# EAGLE design Carte-Marteaux (EAGLE 9.6.2)
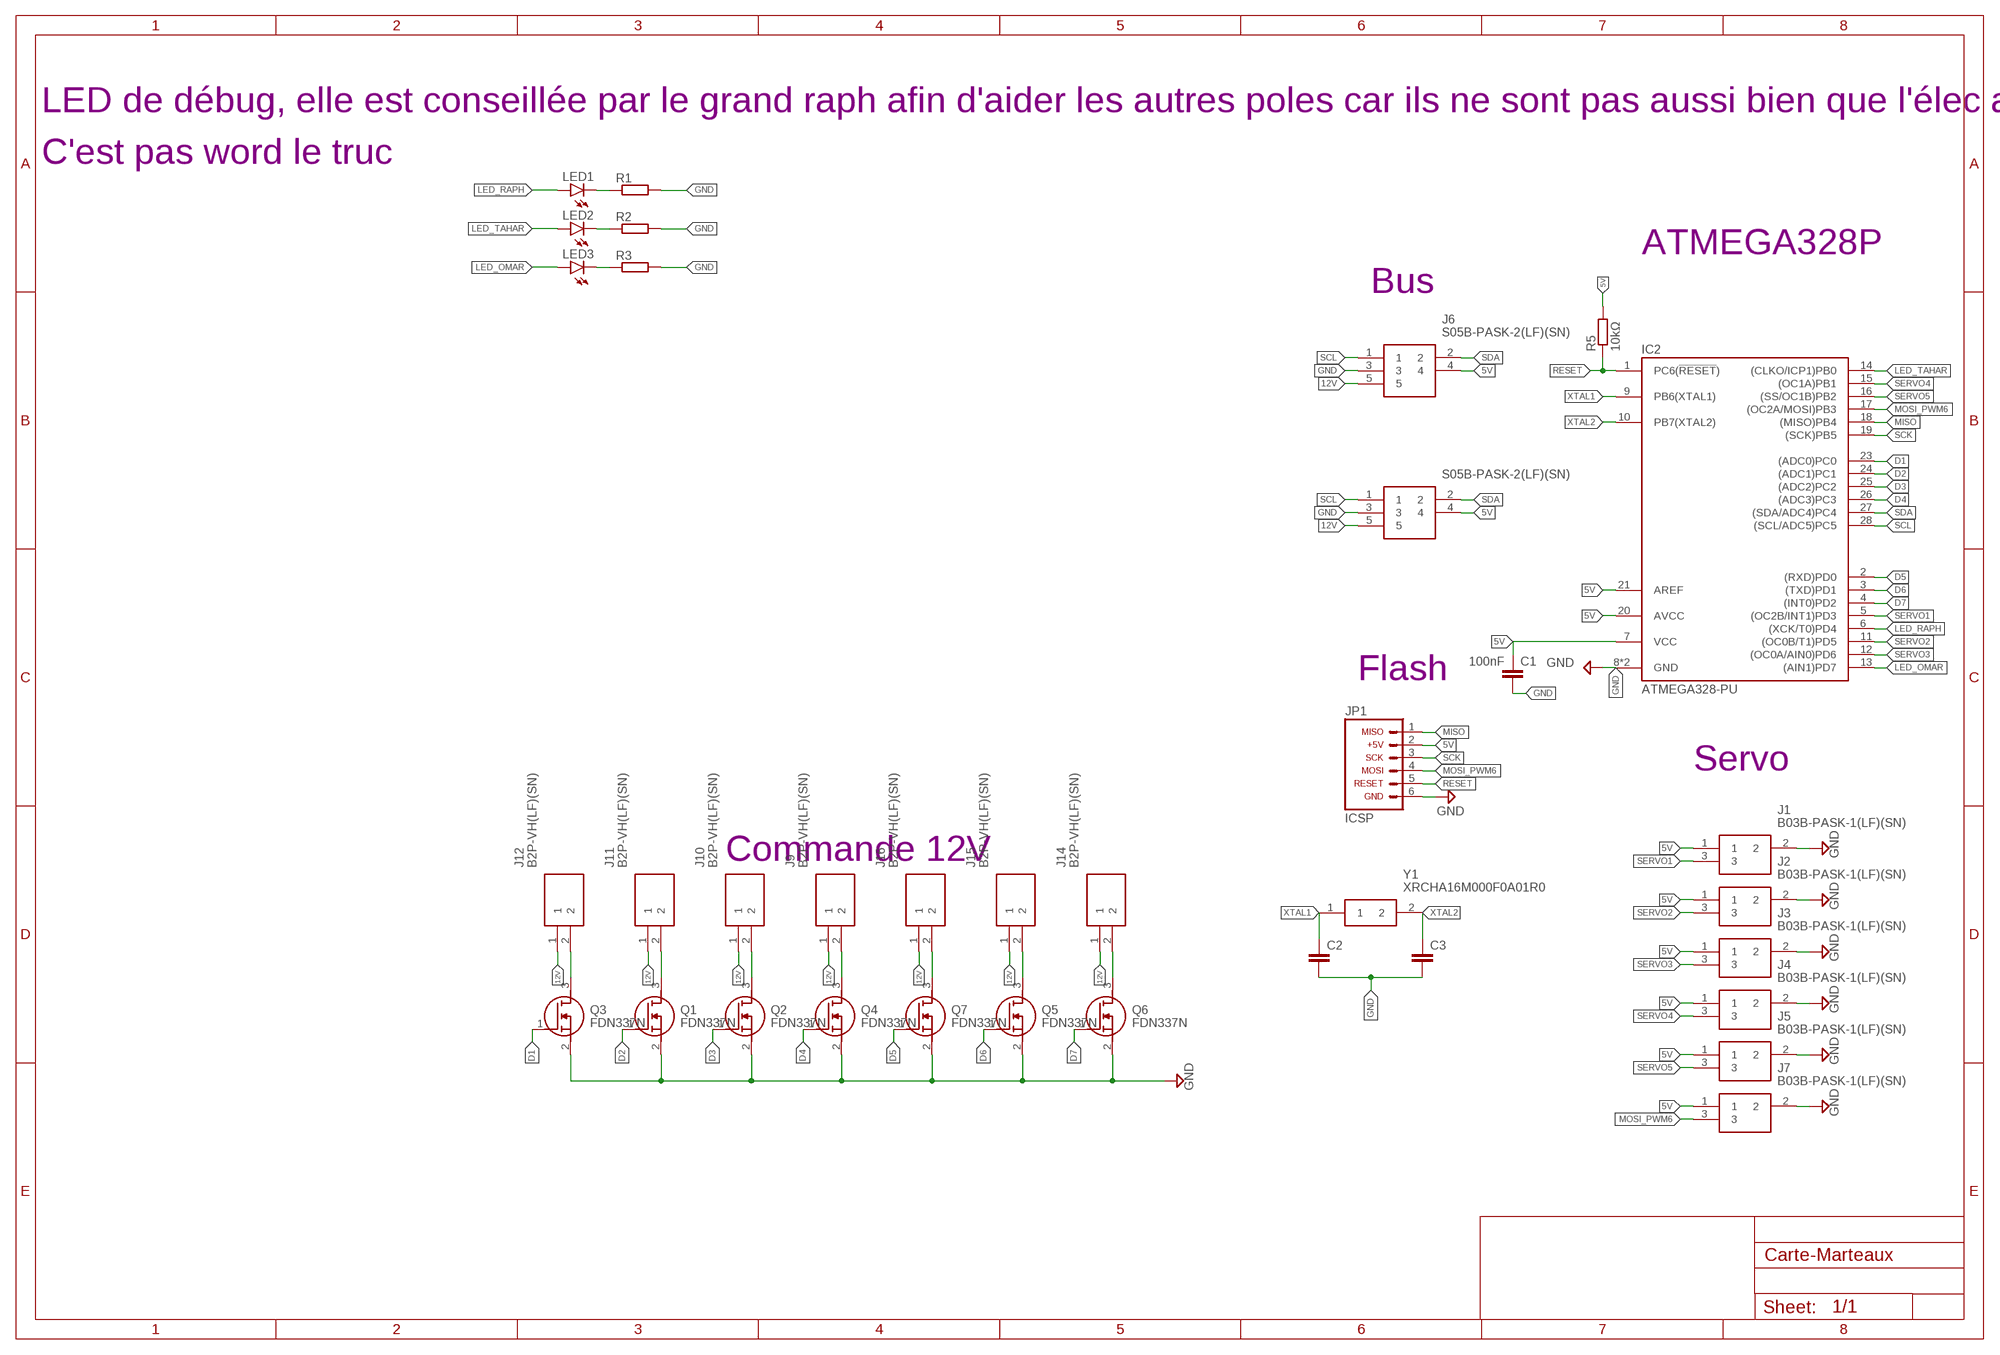
[diagram p0: schematic, sheet 1]

## Parts
C1  100nF  C-EUC0805  [C0805]
C2  C-EUC0402  [C0402]
C3  C-EUC0402  [C0402]
IC2  ATMEGA328-PU  [DIL28]
J1  B03B-PASK-1(LF)(SN)  [B03BPASK1LFSN]
J2  B03B-PASK-1(LF)(SN)  [B03BPASK1LFSN]
J3  B03B-PASK-1(LF)(SN)  [B03BPASK1LFSN]
J4  B03B-PASK-1(LF)(SN)  [B03BPASK1LFSN]
J5  B03B-PASK-1(LF)(SN)  [B03BPASK1LFSN]
J6  S05B-PASK-2(LF)(SN)  [S05B-PASK-2(LF)(SN)]
J7  B03B-PASK-1(LF)(SN)  [B03BPASK1LFSN]
J8  S05B-PASK-2(LF)(SN)  [S05B-PASK-2(LF)(SN)]
J9  B2P-VH(LF)(SN)  [SHDR2W114P0X396_1X2_786X850X94]
J10  B2P-VH(LF)(SN)  [SHDR2W114P0X396_1X2_786X850X94]
J11  B2P-VH(LF)(SN)  [SHDR2W114P0X396_1X2_786X850X94]
J12  B2P-VH(LF)(SN)  [SHDR2W114P0X396_1X2_786X850X94]
J14  B2P-VH(LF)(SN)  [SHDR2W114P0X396_1X2_786X850X94]
J15  B2P-VH(LF)(SN)  [SHDR2W114P0X396_1X2_786X850X94]
J16  B2P-VH(LF)(SN)  [SHDR2W114P0X396_1X2_786X850X94]
JP1  ARDUINO_CONN-ICSP  [CONN-2X03]
LED1  LEDCHIP-LED0805  [CHIP-LED0805]
LED2  LEDCHIP-LED0805  [CHIP-LED0805]
LED3  LEDCHIP-LED0805  [CHIP-LED0805]
Q1  FDN337N  [SOT95P237X112-3N]
Q2  FDN337N  [SOT95P237X112-3N]
Q3  FDN337N  [SOT95P237X112-3N]
Q4  FDN337N  [SOT95P237X112-3N]
Q5  FDN337N  [SOT95P237X112-3N]
Q6  FDN337N  [SOT95P237X112-3N]
Q7  FDN337N  [SOT95P237X112-3N]
R1  R-EU_R0805  [R0805]
R2  R-EU_R0805  [R0805]
R3  R-EU_R0805  [R0805]
R5  10kΩ  R-EU_R0805  [R0805]
Y1  XRCHA16M000F0A01R0  [XRCHA]

## Nets
5V: C1.1 IC2.7(VCC) IC2.20(AVCC) IC2.21(AREF) J1.1 J2.1 J3.1 J4.1 J5.1 J6.4 J7.1 J8.4 JP1.2 R5.2
12V: J6.5 J8.5 J9.1 J10.1 J11.1 J12.1 J14.1 J15.1 J16.1
D1: IC2.23((ADC0)PC0) Q3.1(G)
D2: IC2.24((ADC1)PC1) Q1.1(G)
D3: IC2.25((ADC2)PC2) Q2.1(G)
D4: IC2.26((ADC3)PC3) Q4.1(G)
D5: IC2.2((RXD)PD0) Q7.1(G)
D6: IC2.3((TXD)PD1) Q5.1(G)
D7: IC2.4((INT0)PD2) Q6.1(G)
GND: C1.2 C2.2 C3.2 IC2.8(GND) IC2.22(GND) J1.2 J2.2 J3.2 J4.2 J5.2 J6.3 J7.2 J8.3 JP1.6 Q1.2(S) Q2.2(S) Q3.2(S) Q4.2(S) Q5.2(S) Q6.2(S) Q7.2(S) R1.2 R2.2 R3.2
LED_OMAR: IC2.13((AIN1)PD7) LED3.A
LED_RAPH: IC2.6((XCK/T0)PD4) LED1.A
LED_TAHAR: IC2.14((CLKO/ICP1)PB0) LED2.A
MISO: IC2.18((MISO)PB4) JP1.1
MOSI_PWM6: IC2.17((OC2A/MOSI)PB3) J7.3 JP1.4
N$1: LED1.C R1.1
N$2: LED2.C R2.1
N$3: LED3.C R3.1
N$4: J12.2 Q3.3(D)
N$5: J11.2 Q1.3(D)
N$6: J10.2 Q2.3(D)
N$7: J9.2 Q4.3(D)
N$8: J16.2 Q7.3(D)
N$9: J15.2 Q5.3(D)
N$10: J14.2 Q6.3(D)
RESET: IC2.1(PC6(!RESET!)) JP1.5 R5.1
SCK: IC2.19((SCK)PB5) JP1.3
SCL: IC2.28((SCL/ADC5)PC5) J6.1 J8.1
SDA: IC2.27((SDA/ADC4)PC4) J6.2 J8.2
SERVO1: IC2.5((OC2B/INT1)PD3) J1.3
SERVO2: IC2.11((OC0B/T1)PD5) J2.3
SERVO3: IC2.12((OC0A/AIN0)PD6) J3.3
SERVO4: IC2.15((OC1A)PB1) J4.3
SERVO5: IC2.16((SS/OC1B)PB2) J5.3
XTAL1: C2.1 IC2.9(PB6(XTAL1)) Y1.1
XTAL2: C3.1 IC2.10(PB7(XTAL2)) Y1.2

## Notes on the sheet
- LED de débug, elle est conseillée par le grand raph afin d'aider les autres poles car ils ne sont pas aussi bien que l'élec aka les bg surtout Tahar
- C'est pas word le truc
- ATMEGA328P
- Bus
- Flash
- Servo
- Commande 12V

## Library data of the parts
C1 = INTech:C-EU: CAPACITOR, European symbol; SPICEPREFIX: C
C2 C3 = rcl:C-EU: CAPACITOR, European symbol; SPICEPREFIX: C
IC2 = INTech:ATMEGA328-PU: Atmel ATmega48/88/168/328 AVR Microcontroller; AVAILABILITY: Unavailable; DESCRIPTION: AVR AVR® ATmega Microcontroller IC 8-Bit 20MHz 32KB _16K x 16_ FLASH 28-PDIP; MF: Microchip Technology; MP: ATMEGA328-PU; PACKAGE: DIP-28 Microchip Technology; PRICE: None
J1-J5 J7 = INTech:B03B-PASK-1(LF)(SN): CONN HEADER PA 3POS TOP W/BOSS Source: Datasheet <http://www.jst-mfg.com/product/pdf/eng/ePA-F.pdf>; DESCRIPTION: CONN HEADER PA 3POS TOP W/BOSS; HEIGHT: 7mm; MANUFACTURER_NAME: JST (JAPAN SOLDERLESS TERMINALS); MANUFACTURER_PART_NUMBER: B03B-PASK-1(LF)(SN)
J6 J8 = INTech:S05B-PASK-2(LF)(SN): CONN HEADER PA 5POS SIDE 2MM TIN Source: Datasheet <http://www.jst-mfg.com/product/pdf/eng/ePA-F.pdf>; DESCRIPTION: CONN HEADER PA 5POS SIDE 2MM TIN; HEIGHT: mm; MANUFACTURER_NAME: JST (JAPAN SOLDERLESS TERMINALS); MANUFACTURER_PART_NUMBER: S05B-PASK-2(LF)(SN)
J9-J12 J14-J16 = INTech:B2P-VH(LF)(SN): connector,multipole PCB use,B2P-VH,VH se JST VH Series, 3.96mm Pitch 2 Way 1 Row Straight PCB Header, Solder Termination, 10A Source: Datasheet <http://www.jst-mfg.com/product/pdf/eng/eVH.pdf>; DESCRIPTION: connector,multipole PCB use,B2P-VH,VH se JST VH Series, 3.96mm Pitch 2 Way 1 Row Straight PCB Header, Solder Termination, 10A; HEIGHT: 9.4mm; MANUFACTURER_NAME: JST (JAPAN SOLDERLESS TERMINALS); MANUFACTURER_PART_NUMBER: B2P-VH(LF)(SN); RS_PART_NUMBER: 8201147P; RS_PRICE-STOCK: http://uk.rs-online.com/web/p/products/8201147P
JP1 = INTech:ARDUINO_CONN-ICSP: Arduino ICSP I/O Header This is the ICSP I/O header on the Arduino Uno R3. This connector is labeled with the following pin assignments: MISO +5V SCK MOSI RESET GND NOTE: Be sure you install this connector with the correct orientation on your PCB layout. Pin 1 has a square pad to assist with orientation.
LED1-LED3 = INTech:LED: LED OSRAM: - CHIPLED LG R971, LG N971, LY N971, LG Q971, LY Q971, LO R971, LY R971 LH N974, LH R974 LS Q976, LO Q976, LY Q976 LO Q996 - Hyper CHIPLED LW Q18S LB Q993, LB Q99A, LB R99A - SideLED LS A670, LO A670, LY A670, LG A670, LP A670 LB A673, LV A673, LT A673, LW A673 LH A674 LY A675 LS A676, LA A676, LO A676, LY A676, LW A676 LS A679, LY A679, LG A679 - Hyper Micro SIDELED® LS Y876, LA Y876, LO Y876, LY Y876 LT Y87S - SmartLED LW L88C, LW L88S LB L89C, LB L89S, LG L890 LS L89K, LO L89K, LY L89K LS L896, LA L896, LO L896, LY L896 - TOPLED LS T670, LO T670, LY T670, LG T670, LP T670 LSG T670, LSP T670, LSY T670, LOP T670, LYG T670 LG T671, LOG T671, LSG T671 LB T673, LV T673, LT T673, LW T673 LH T674 LS T676, LA T676, LO T676, LY T676, LB T676, LH T676, LSB T676, LW T676 LB T67C, LV T67C, LT T67C, LS T67K, LO T67K, LY T67K, LW E67C LS E67B, LA E67B, LO E67B, LY E67B, LB E67C, LV E67C, LT E67C LW T67C LS T679, LY T679, LG T679 LS T770, LO T770, LY T770, LG T770, LP T770 LB T773, LV T773, LT T773, LW T773 LH T774 LS E675, LA E675, LY E675, LS T675 LS T776, LA T776, LO T776, LY T776, LB T776 LHGB T686 LT T68C, LB T68C - Hyper Mini TOPLED® LB M676 - Mini TOPLED Santana® LG M470 LS M47K, LO M47K, LY M47K Source: http://www.osram.convergy.de LUXEON: - LUMILED® LXK2-PW12-R00, LXK2-PW12-S00, LXK2-PW14-U00, LXK2-PW14-V00 LXK2-PM12-R00, LXK2-PM12-S00, LXK2-PM14-U00 LXK2-PE12-Q00, LXK2-PE12-R00, LXK2-PE12-S00, LXK2-PE14-T00, LXK2-PE14-U00 LXK2-PB12-K00, LXK2-PB12-L00, LXK2-PB12-M00, LXK2-PB14-N00, LXK2-PB14-P00, LXK2-PB14-Q00 LXK2-PR12-L00, LXK2-PR12-M00, LXK2-PR14-Q00, LXK2-PR14-R00 LXK2-PD12-Q00, LXK2-PD12-R00, LXK2-PD12-S00 LXK2-PH12-R00, LXK2-PH12-S00 LXK2-PL12-P00, LXK2-PL12-Q00, LXK2-PL12-R00 Source: www.luxeon.com KINGBRIGHT: KA-3528ASYC Source: www.kingbright.com
Q1-Q7 = INTech:FDN337N: FDN337N N-Channel MOSFET, 2.2 A, 30 V, 3-Pin SOT-23 ON Semiconductor Source: Datasheet <https://www.onsemi.com/pub/Collateral/FDN337N-D.PDF>; DESCRIPTION: FDN337N N-Channel MOSFET, 2.2 A, 30 V, 3-Pin SOT-23 ON Semiconductor; HEIGHT: 1.12mm; MANUFACTURER_NAME: ON Semiconductor; MANUFACTURER_PART_NUMBER: FDN337N; MOUSER_PART_NUMBER: 512-FDN337N; MOUSER_PRICE-STOCK: https://www.mouser.com/Search/Refine.aspx?Keyword=512-FDN337N; RS_PART_NUMBER: 6710429P; RS_PRICE-STOCK: http://uk.rs-online.com/web/p/products/6710429P
R1-R3 R5 = INTech:R-EU_: RESISTOR, European symbol; SPICEPREFIX: R
Y1 = INTech:XRCHA16M000F0A01R0: Crystal Unit for Automotive, 16.0000 MHz, 100 ESR, 8pF Source: Datasheet <http://www.murata.com/~/media/webrenewal/products/timingdevice/crystalu/flyers/vppt-hcrj078-d.ashx?la=en-us>; DESCRIPTION: Crystal Unit for Automotive, 16.0000 MHz, 100 ESR, 8pF; HEIGHT: mm; MANUFACTURER_NAME: Murata Electronics; MANUFACTURER_PART_NUMBER: XRCHA16M000F0A01R0; MOUSER_PART_NUMBER: 81-XRCHA16M000F0A1R0; MOUSER_PRICE-STOCK: https://www.mouser.com/Search/Refine.aspx?Keyword=81-XRCHA16M000F0A1R0; RS_PART_NUMBER: 1446622; RS_PRICE-STOCK: http://uk.rs-online.com/web/p/products/1446622

## Board
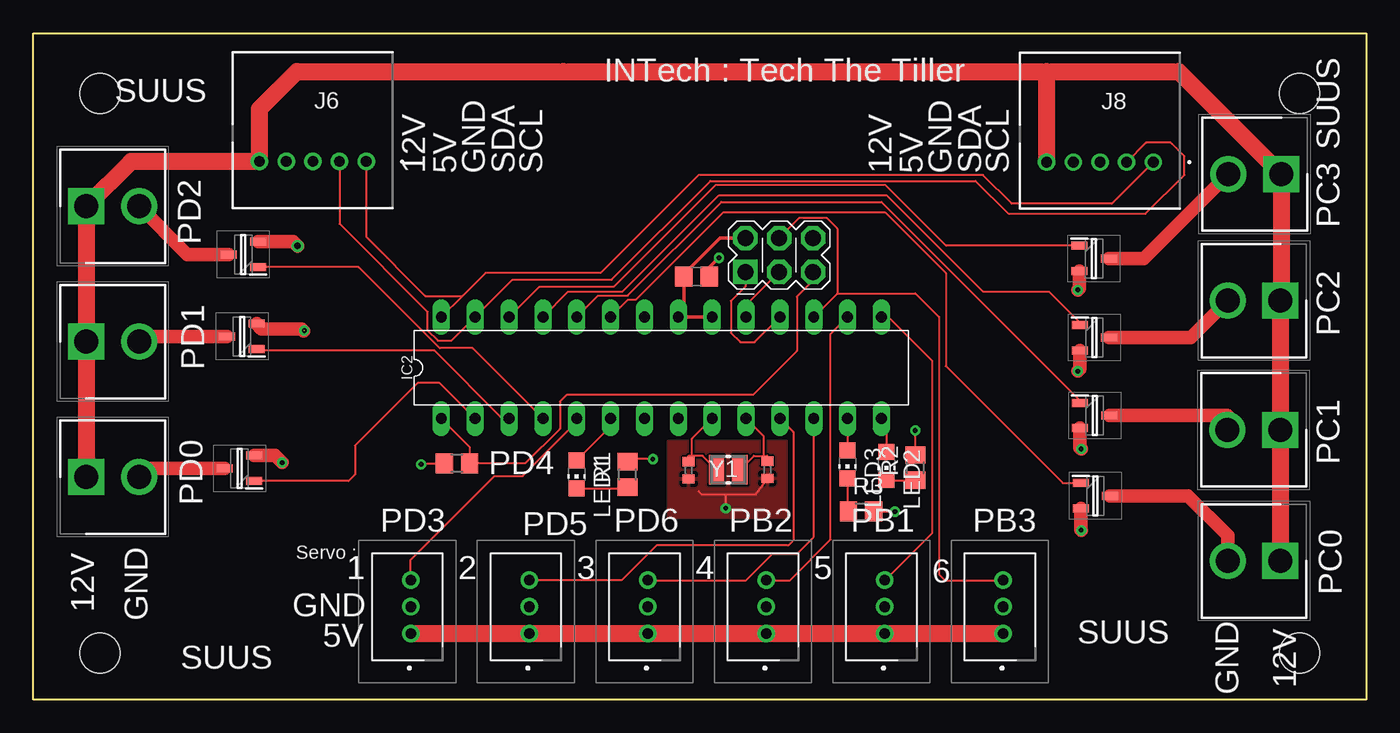
[diagram p1: board, top side]
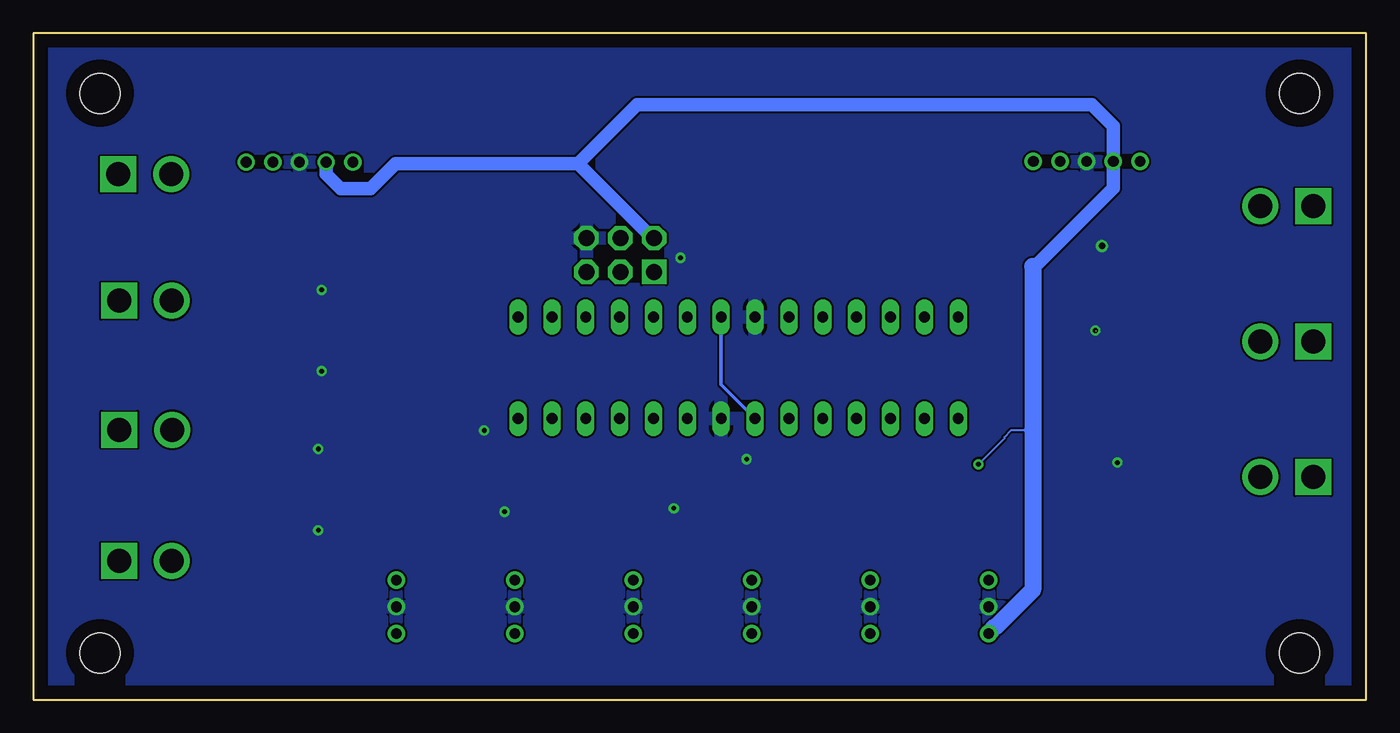
[diagram p2: board, bottom side, seen from below]

Size 100 x 50 mm. Coordinates in mm from the lower left corner, seen from the top.
Outline: 0,50 100,50 100,0 0,0 0,50
Copper layers (1*16): Top 0.035mm / dielectric 1.5mm / Bottom 0.035mm
Design rules "default": minimum track width 6mil, minimum drill 0.35mm, track to track 6mil, track to pad 6mil, pad to pad 6mil, via to via 6mil, smd to smd 6mil, copper to edge 40mil, drill to drill 6mil, minimum pad ring 10mil, minimum via ring 8mil, stop-mask expansion 4mil, vias tented up to drill 0mil, thermal gap 10mil
Holes 3 mm at 5,45.5 95,45.5 95,3.5 5,3.5

### Footprints (pad centres in the part's own frame; a part is rotated, then mirrored left to right if it is on the bottom)
C0805 = smd 1.3 x 1.5: 1 -0.95,0; 2 0.95,0
C0402 = smd 0.7 x 0.9: 1 -0.65,0; 2 0.65,0
DIL28 = drill 0.813 long: 1 -3.81,16.51; 2 -3.81,13.97; 3 -3.81,11.43; 4 -3.81,8.89; 5 -3.81,6.35; 6 -3.81,3.81; 7 -3.81,1.27; 8 -3.81,-1.27; 9 -3.81,-3.81; 10 -3.81,-6.35; 11 -3.81,-8.89; 12 -3.81,-11.43; 13 -3.81,-13.97; 14 -3.81,-16.51; 15 3.81,-16.51; 16 3.81,-13.97; 17 3.81,-11.43; 18 3.81,-8.89; 19 3.81,-6.35; 20 3.81,-3.81; 21 3.81,-1.27; 22 3.81,1.27; 23 3.81,3.81; 24 3.81,6.35; 25 3.81,8.89; 26 3.81,11.43; 27 3.81,13.97; 28 3.81,16.51
B03BPASK1LFSN = drill 0.8 pad 1.3: 1 1.65,0.25; 2 -0.35,0.25; 3 -2.35,0.25
S05B-PASK-2(LF)(SN) = drill 0.8 pad 1.3: 1 4,-2.1; 2 2,-2.1; 3 0,-2.1; 4 -2,-2.1; 5 -4,-2.1
SHDR2W114P0X396_1X2_786X850X94 = drill 1.8 pad 2.7 square: 1 0,0 | drill 1.8 pad 2.7: 2 3.96,0
CONN-2X03 = drill 1.2 pad 1.829 square: 1 0,0 | drill 1.2 pad 1.829 octagon: 2 2.54,0; 3 0,-2.54; 4 2.54,-2.54; 5 0,-5.08; 6 2.54,-5.08
CHIP-LED0805 = smd 1.2 x 1.2: A 0,-1.05; C 0,1.05
SOT95P237X112-3N = smd 1.2 x 0.6: 1 -1.1,0.95; 2 -1.1,-0.95; 3 1.1,0
R0805 = smd 1.3 x 1.5: 1 -0.95,0; 2 0.95,0
XRCHA = smd 1.15 x 2.2: 1 -0.875,0; 2 0.875,0

### Placement (x,y rotation side)
C1  49.76,31.74 0 top
C2  49.17,17.2 270 top
C3  55.07,17.24 270 top
IC2  47.12,24.9 90 top
J1  28.07,6.61 270 top
J2  36.96,6.61 270 top
J3  45.85,6.61 270 top
J4  63.63,6.61 270 top
J5  54.74,6.61 270 top
J6  20.97,42.48 0 top
J7  72.52,6.61 270 top
J8  80.03,42.43 0 top
J9  93.62,39.43 180 top
J10  93.57,29.93 180 top
J11  93.55,20.25 180 top
J12  93.57,10.39 180 top
J14  3.98,37.01 0 top
J15  3.98,26.85 0 top
J16  3.98,16.69 0 top
JP1  53.42,32.09 90 top
LED1  40.77,16.9 180 top
LED2  64.01,17.53 180 top
LED3  61.09,17.66 180 top
Q1  79.63,21.32 0 top
Q2  79.61,27.16 0 top
Q3  79.68,15.3 0 top
Q4  79.58,33.1 0 top
Q5  15.65,27.26 180 top
Q6  15.75,33.41 180 top
Q7  15.47,17.35 180 top
R1  44.58,16.9 90 top
R2  66.17,17.4 90 top
R3  62.11,14.1 0 top
R5  31.78,17.73 180 top
Y1  52.14,17.24 0 top

### Tracks (layer width: path | path; a pad name or v marks a point on that pad's centre or on a via)
5V  (via drill 0.35)
  Top 0.152: v29.09,17.66 29.16,17.73 R5.2
  Top 0.254: IC2.20 IC2.21 48.81,29.12 C1.1 48.81,31.92 51.52,34.63 JP1.2
  Top 1.27: J1.1 J2.1 J3.1 J5.1 J4.1 J7.1
  Bottom 0.152: v29.09,17.66 27.16,19.59 27.16,19.69 26.64,20.2 25.02,20.2
  Bottom 0.254: IC2.21 48.39,23.63 IC2.7
  Bottom 1.016: JP1.2 53.55,34.63 59.13,40.2 | 59.13,40.2 72.83,40.2 74.68,38.36 76.95,38.36 78.03,39.44 J8.4 | 25.02,32.52 24.83,32.52 18.97,38.38 J6.4 18.97,43.03 20.57,44.63 54.7,44.63 59.13,40.2
  Bottom 1.27: 25.02,32.52 25.02,20.2 25.02,8.22 27.73,5.52 27.76,5.52 J1.1
12V
  Top 1.27: 39.79,47.08 39.76,47.12 | 39.76,47.12 76.03,47.12 | 76.03,47.12 85.93,47.12 J9.1 93.62,29.98 J10.1 93.57,20.27 J11.1 93.55,10.42 J12.1 | J8.5 76.03,47.12 | J16.1 J15.1 J14.1 7.34,40.38 J6.5 16.97,44.33 19.77,47.12 39.76,47.12
D1
  Top 0.152: IC2.23 44.61,30 45.22,30 51.79,36.58 63.89,36.58 68.46,32.01 68.46,25.02 77.24,16.25 Q3.1
D2
  Top 0.152: IC2.24 42.37,30.31 44.58,30.31 51.62,37.34 63.63,37.34 78.53,22.44 Q1.1
D3
  Top 0.152: IC2.25 40.14,30.61 44.2,30.61 51.44,37.85 64.01,37.85 71.25,30.61 76.18,30.61 78.51,28.28 Q2.1
D4
  Top 0.152: IC2.26 37.98,30.99 43.57,30.99 51.19,38.61 63.92,38.61 68.48,34.05 Q4.1
D5
  Top 0.152: 32.91,21.09 IC2.2 30.48,23.75 28.83,23.75 24.14,19.05 24.14,16.9 23.64,16.4 Q7.1
D6
  Top 0.152: IC2.3 35.18,21.09 30.09,26.18 16.88,26.18 Q5.1
D7
  Top 0.152: IC2.4 32.95,26.37 30.49,26.37 24.4,32.46 Q6.1
GND  (via drill 0.35, 0.5)  (1 unrouted)
  Top 0.152: 45.85,29.72 IC2.22 | C3.2 54.15,15.37 51.95,15.37 | 49.92,15.63 50.17,15.37 51.95,15.37 | 51.95,15.37 v51.95,14.36 | v46.49,18.04 44.77,18.04 R1.2 | R3.2 v64.65,14.1 | R2.2 v66.17,20.2
  Top 0.254: C1.2 50.71,32.42 v51.44,33.15
  Top 1.016: Q4.2 78.48,30.86 v78.36,30.74 | Q2.2 78.51,24.79 v78.36,24.64 | Q1.2 78.53,18.89 v78.62,18.8 | Q3.2 78.58,12.74 v78.62,12.7 | Q5.2 17.14,27.82 20.12,27.82 20.29,27.65 | v18.67,17.78 18.16,18.3 Q7.2 | Q6.2 19.5,34.36 v19.82,34.04
  other vias: 20.32,27.69
  pour Bottom: -3.27,52.63 102,52.63 102,-2.84 -3.27,-2.84
  pour Top: 56.52,19.44 56.52,13.59 47.63,13.59 47.63,19.44
LED_OMAR
  Top 0.152: IC2.13 LED3.A
LED_RAPH
  Top 0.152: IC2.6 43.31,20.49 LED1.A
LED_TAHAR
  Top 0.152: IC2.14 64.01,20.71 LED2.A
MISO
  Top 0.152: JP1.1 53.42,31 52.34,29.92 52.34,27.52 53.04,26.82 54.12,26.82 IC2.18
MOSI_PWM6
  Top 0.152: JP1.4 57.49,36.15 59.52,36.15 60.33,35.34 60.33,30.48 | IC2.17 60.33,30.48 | 60.33,30.48 66.17,30.48 67.95,28.71 67.95,9.4 68.39,8.96 J7.3
N$1
  Top 0.152: LED1.C 44.48,15.85 R1.1
N$2
  Top 0.152: LED2.C 64.04,16.45 R2.1
N$3
  Top 0.152: LED3.C 61.09,14.17 R3.1
N$4
  Top 1.016: Q3.3 86.61,15.3 89.61,12.3 J12.2
N$5
  Top 1.016: Q1.3 89.59,21.32 J11.2
N$6
  Top 1.016: J10.2 86.84,27.16 Q2.3
N$7
  Top 1.016: J9.2 83.34,33.1 Q4.3
N$8
  Top 1.016: Q7.3 8.6,17.35 J16.2
N$9
  Top 1.016: Q5.3 8.34,27.26 J15.2
N$10
  Top 1.016: Q6.3 11.54,33.41 J14.2
RESET
  Top 0.152: JP1.5 58.5,31.45 57.28,30.23 57.28,26.17 53.98,22.86 40.01,22.86 39.5,22.36 39.5,20.32 36.91,17.73 R5.1 32.73,18.97 IC2.1
SCK
  Top 0.152: JP1.3 53.47,29.6
  Top 0.2: 53.47,29.6 IC2.19
SCL
  Top 0.152: 32.2,30.29 33.91,32.01 42.55,32.01 49.92,39.38 71.25,39.38 73.41,37.22 80.91,37.22 J8.1 | 32.2,30.29 IC2.28 | J6.1 24.97,34.73 29.41,30.29 32.2,30.29
SDA
  Top 0.152: J6.2 22.97,35.71 29.6,29.09 29.6,27.69 30.36,26.93 31.37,26.93 IC2.27 35.95,31.5 43.39,31.5 50.81,38.92 70.69,38.92 73.16,36.45 83.44,36.45 86.36,39.38 86.36,40.77 85.35,41.79 83.49,41.79 J8.2
SERVO1
  Top 0.152: J1.3 28.32,10.48 34.61,16.77 36.71,16.77 40.77,20.83 IC2.5
SERVO2
  Top 0.152: J2.3 44.14,8.96 46.74,11.56 56.65,11.56 57.03,11.94 57.03,20.07 IC2.11
SERVO3
  Top 0.152: J3.3 53.47,8.96 55.44,10.93 57.28,10.93 58.55,12.2 IC2.12
SERVO4
  Top 0.152: J4.3 67.44,12.52 67.44,25.41 64.14,28.71 IC2.15
SERVO5
  Top 0.152: J5.3 56.77,8.96 59.82,12.01 59.82,27.44 IC2.16
XTAL1
  Top 0.152: C2.1 49.17,18.29 49.42,18.29 | 49.42,18.29 49.42,19.58 IC2.9 | Y1.1 50.21,18.29 49.42,18.29
XTAL2
  Top 0.152: C3.1 55.07,18.29 54.81,18.29 | 54.81,18.29 54.81,19.75 IC2.10 | Y1.2 54.06,18.29 54.81,18.29

### Text on the board
tPlace: INTech : Tech The Tiller | SUUS | SUUS | 12V | 5V | GND | SDA | SCL | 12V | 5V | GND | SDA | SCL | PC3 | PD2 | PC2 | PD1 | PC1 | PD4 | PD0 | PD3 | PD6 | PB2 | PB1 | PB3 | PD5 | Servo : | 1 | 2 | 3 | 4 | 5 | 6 | PC0 | 12V | GND | GND | SUUS | 12V | 5V | SUUS | GND